# Altium schematic sheet Connectors.SchDoc
size A; SheetNumber: 2; SheetTotal: 6
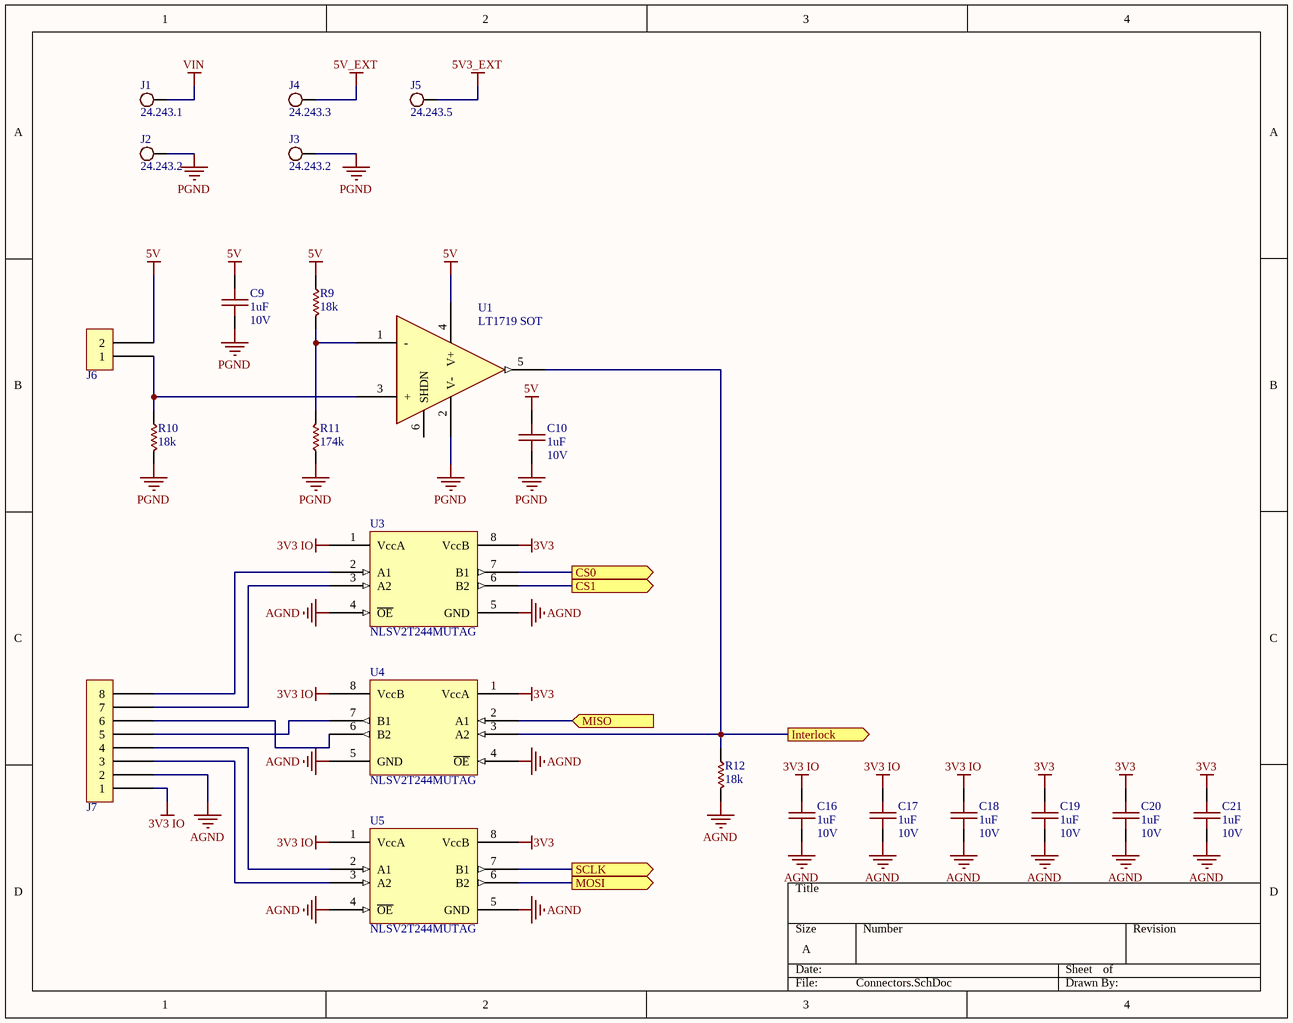
[diagram p0: Connectors.SchDoc]

## Parts
C9  1uF  Voltage: 10V  [0603 B]
C10  1uF  Voltage: 10V  [0603 B]
C16  1uF  Voltage: 10V  [0603 B]
C17  1uF  Voltage: 10V  [0603 B]
C18  1uF  Voltage: 10V  [0603 B]
C19  1uF  Voltage: 10V  [0603 B]
C20  1uF  Voltage: 10V  [0603 B]
C21  1uF  Voltage: 10V  [0603 B]
J1  24.243.1  [BANANA RD]  (no BOM)
J2  24.243.2  [BANANA BK]  (no BOM)
J3  24.243.2  [BANANA BK]  (no BOM)
J4  24.243.3  [BANANA YL]  (no BOM)
J5  24.243.5  [BANANA BU]  (no BOM)
J6  SIL02  [SIL02]  (value not drawn)
J7  SIL08  [SIL08]  (value not drawn)
R9  18k  [0603]
R10  18k  [0603]
R11  174k  [0603]
R12  18k  [0603]
U1  LT1719 SOT  [TSOT-23-6]
U3  NLSV2T244MUTAG  [UDFN8]
U4  NLSV2T244MUTAG  [UDFN8]
U5  NLSV2T244MUTAG  [UDFN8]

## Ports
CS0 (out), CS1 (out), Interlock (out), MISO (in), MOSI (out), SCLK (out)

## Nets
3V3: C19.2 C20.2 C21.2 U3.8(VccB) U4.1(VccA) U5.8(VccB)
3V3 IO: C16.2 C17.2 C18.2 J7.1 U3.1(VccA) U4.8(VccB) U5.1(VccA)
5V: C9.2 C10.2 J6.2 R9.2 U1.4(V+)
5V3_EXT: J5.1(TP)
5V_EXT: J4.1(TP)
AGND: C16.1 C17.1 C18.1 C19.1 C20.1 C21.1 J7.2 R12.1 U3.4(~{OE}) U3.5(GND) U4.4(~{OE}) U4.5(GND) U5.4(~{OE}) U5.5(GND)
PGND: C9.1 C10.1 J2.1(TP) J3.1(TP) R10.1 R11.2 U1.2(V-)
VIN: J1.1(TP)
CS0: U3.7(B1) ; port CS0
CS1: U3.6(B2) ; port CS1
Interlock: R12.2 U1.5(OUT) U4.3(A2) ; port Interlock
MISO: U4.2(A1) ; port MISO
MOSI: U5.6(B2) ; port MOSI
SCLK: U5.7(B1) ; port SCLK
NetJ6_1: J6.1 R10.2 U1.3(+)
NetJ7_3: J7.3 U5.3(A2)
NetJ7_4: J7.4 U5.2(A1)
NetJ7_5: J7.5 U4.7(B1)
NetJ7_6: J7.6 U4.6(B2)
NetJ7_7: J7.7 U3.3(A2)
NetJ7_8: J7.8 U3.2(A1)
NetR9_1: R9.1 R11.1 U1.1(-)

Not connected (* = marked no-connect by the designer): U1 6(SHDN)

## Library data of the parts
C9 C10 C16-C21 = CAP 0603: 603 Capacitor; Ref: C1608X7R1E105M080AB; Rating: X7R; Value: 1uF
J1 = BANANA RED: Banana jack, PCB mount right angle; Ref: 24.243.1
J2 J3 = BANANA BLACK: Banana jack, PCB mount right angle; Ref: 24.243.2
J4 = BANANA YELLOW: Banana jack, PCB mount right angle; Ref: 24.243.3
J5 = BANANA BLUE: Banana jack, PCB mount right angle; Ref: 24.243.5
J6 = SIL02: 2.54mm Header 1x2; Ref: 4x1 2.54MM HEADER
J7 = SIL08: 2.54mm Header 1x6; Ref: 4x1 2.54MM HEADER
R9-R12 = RES 0603: 603 Resistor
  R9 R10 R12: Value: 18k
  R11: Value: 174k
U1 = LT1719 SOT: 4.5ns Comparator with rail-torail output; Ref: LT1719IS6#PBF
U3-U5 = NLSV2T244MUTAG: Voltage Level Translator Unidirectional 1 Circuit 2 Channel - 8-UDFN (1.8x1.2); Supplier 1: Digi-Key; Supplier Part Number 1: NLSV2T244MUTAGOSCT-ND; Ref: NLSV2T244MUTAG